# EAGLE schematic MainBoard_project (EAGLE 9.2.2)
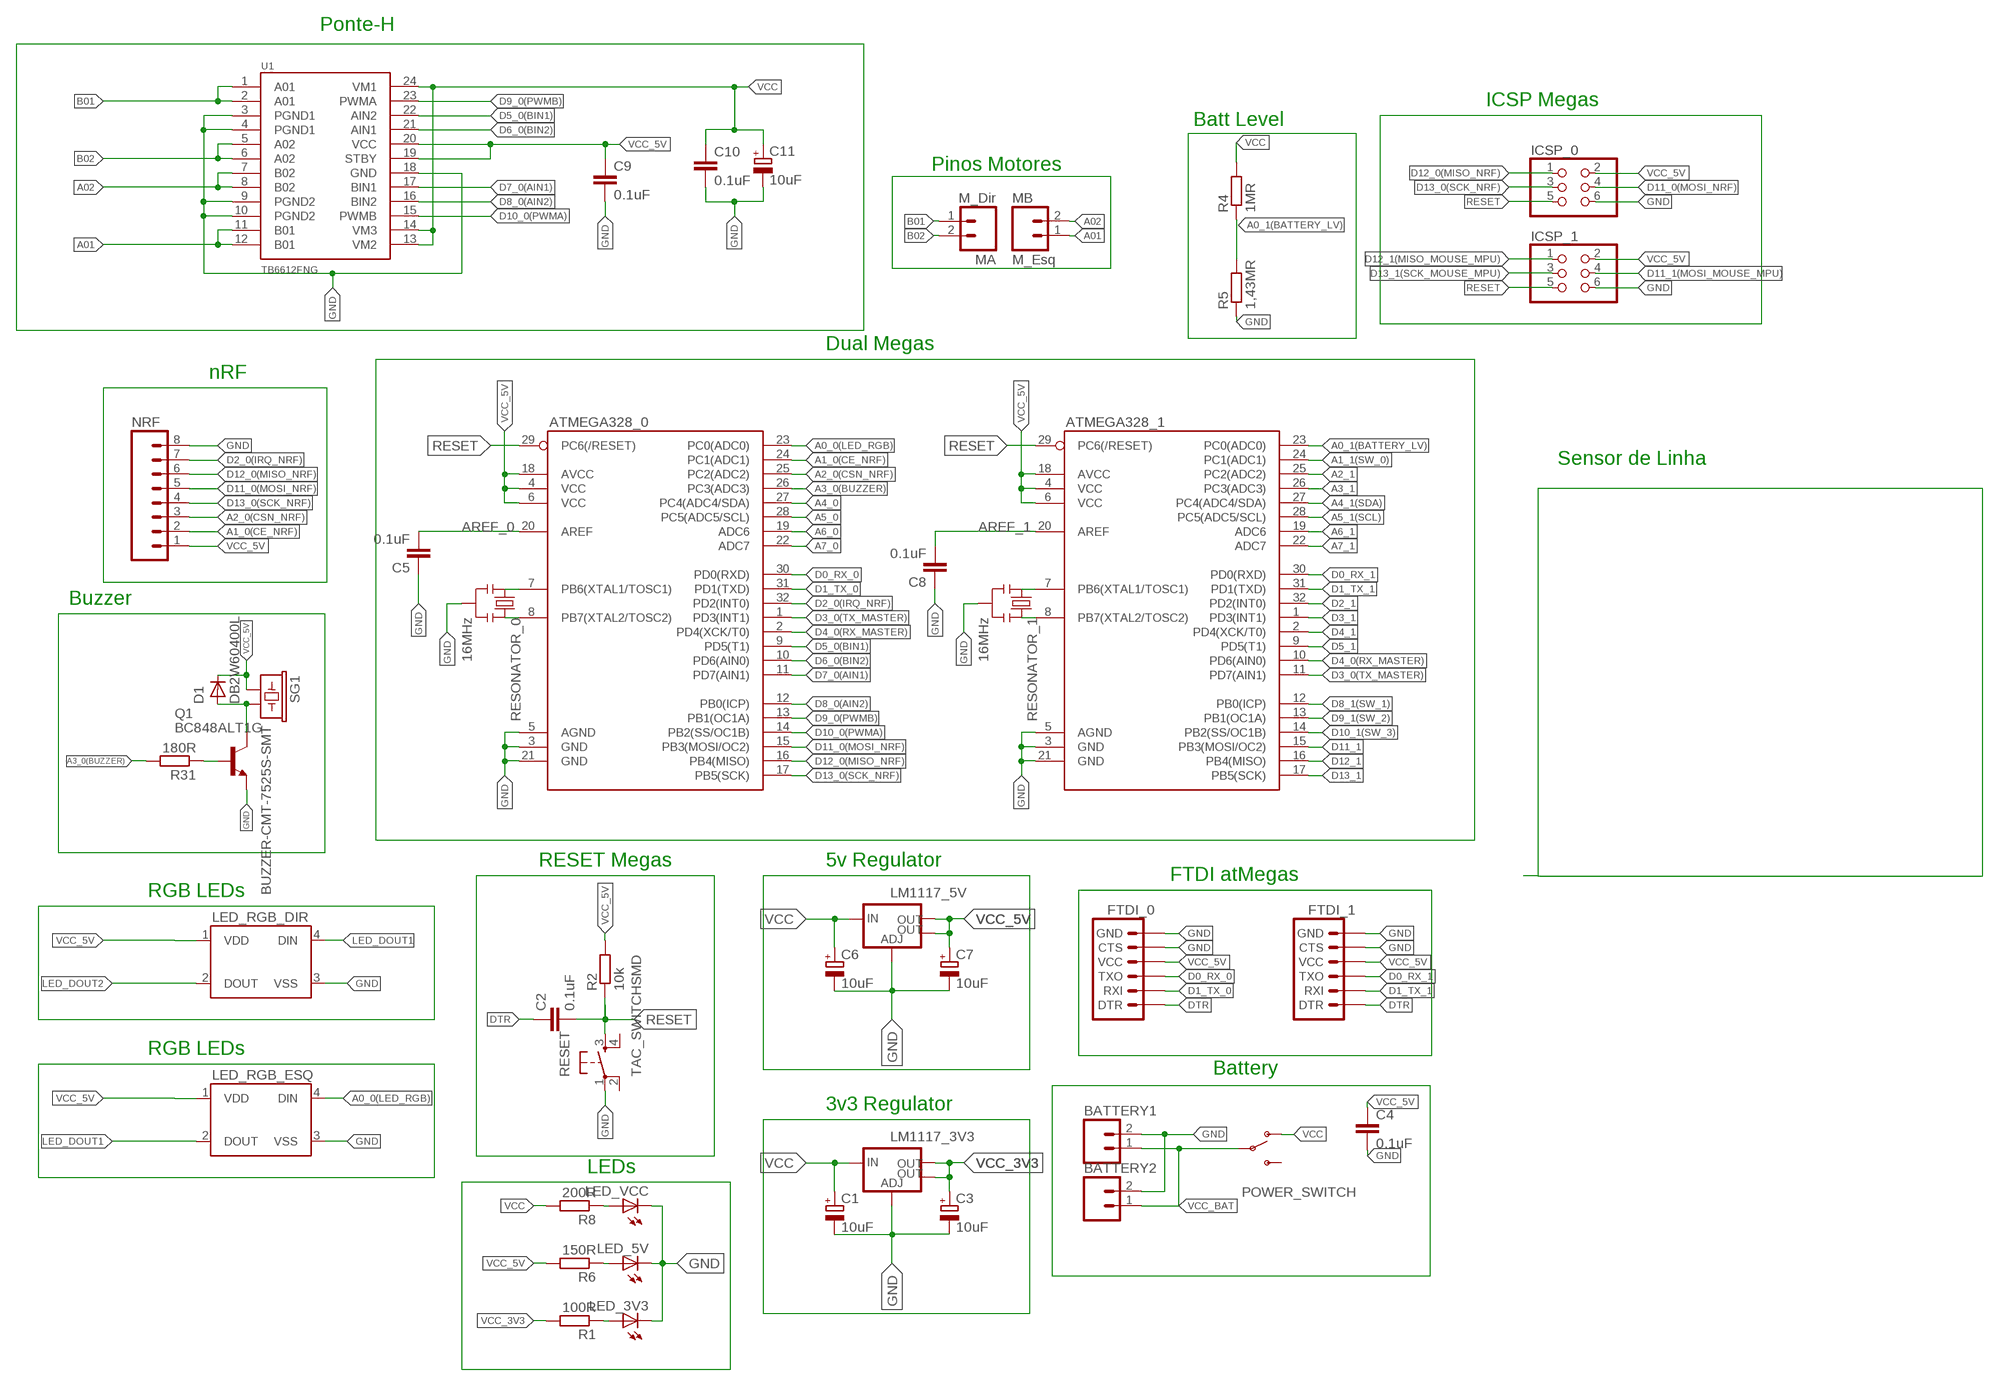
[diagram p0: schematic, sheet 1]

## Parts
ATMEGA328_0  ATMEGA168  [TQFP32-08]
ATMEGA328_1  ATMEGA168  [TQFP32-08]
BATTERY1  M02POLAR  [MOLEX-1X2]
BATTERY2  M02POLAR  [MOLEX-1X2]
C1  10uF  CPOL-EUB/3528-21W  [B/3528-21W]
C2  0.1uF  C-EUC0805K  [C0805K]
C3  10uF  CPOL-EUB/3528-21W  [B/3528-21W]
C4  0.1uF  C-EUC0805K  [C0805K]
C5  0.1uF  C-EUC0805K  [C0805K]
C6  10uF  CPOL-EUB/3528-21W  [B/3528-21W]
C7  10uF  CPOL-EUB/3528-21W  [B/3528-21W]
C8  0.1uF  C-EUC0805K  [C0805K]
C9  0.1uF  C-EUC0805K  [C0805K]
C10  0.1uF  C-EUC0805K  [C0805K]
C11  10uF  CPOL-EUB/3528-21W  [B/3528-21W]
D1  DB2W60400L  GF1  [SMA-DO214AC]
FTDI_0  ARDUINO_SERIAL_PROGRAMPTH  [1X06]
FTDI_1  ARDUINO_SERIAL_PROGRAMPTH  [1X06]
ICSP_0  0114_PH254-203DF118A00V  [2X03]
ICSP_1  0114_PH254-203DF118A00V  [2X03]
LED_3V3  LEDCHIP-LED0805  [CHIP-LED0805]
LED_5V  LEDCHIP-LED0805  [CHIP-LED0805]
LED_RGB_DIR  WS2812B  [WS2812B]
LED_RGB_ESQ  WS2812B  [WS2812B]
LED_VCC  LEDCHIP-LED0805  [CHIP-LED0805]
LM1117_3V3  V_REG_LM1117SOT223  [SOT223]
LM1117_5V  V_REG_LM1117SOT223  [SOT223]
MA  M_Dir  M02POLAR  [MOLEX-1X2]
MB  M_Esq  M02POLAR  [MOLEX-1X2]
NRF  M08  [1X08_ROUND]
POWER_SWITCH  SWITCH-SPDTPTH  [SWITCH-SPDT]
Q1  BC848ALT1G  BC848ALT1SMD  [SOT23]
R1  100R  R-EU_R0805  [R0805]
R2  10k  R-EU_R0805  [R0805]
R4  1MR  R-EU_R0805  [R0805]
R5  1,43MR  R-EU_R0805  [R0805]
R6  150R  R-EU_R0805  [R0805]
R8  200R  R-EU_R0805  [R0805]
R31  180R  R-EU_R0805  [R0805]
RESET  TAC_SWITCHSMD  [TACTILE-SWITCH-SMD]
RESONATOR_0  16MHz  RESONATOR16MHZ  [RESONATOR-SMD]
RESONATOR_1  16MHz  RESONATOR16MHZ  [RESONATOR-SMD]
SG1  BUZZER-CMT-7525S-SMT  [CMT-7525S-SMT]
U1  TB6612FNG  TB6621FNG  [SSOP24]

## Nets
A0_0(LED_RGB): ATMEGA328_0.23(PC0(ADC0)) LED_RGB_ESQ.4(DIN)
A0_1(BATTERY_LV): ATMEGA328_1.23(PC0(ADC0)) R4.1 R5.2
A01: MB.1 U1.11(B01) U1.12(B01)
A1_0(CE_NRF): ATMEGA328_0.24(PC1(ADC1)) NRF.2
A1_1(SW_0): ATMEGA328_1.24(PC1(ADC1))
A02: MB.2 U1.7(B02) U1.8(B02)
A2_0(CSN_NRF): ATMEGA328_0.25(PC2(ADC2)) NRF.3
A2_1: ATMEGA328_1.25(PC2(ADC2))
A3_0(BUZZER): ATMEGA328_0.26(PC3(ADC3)) R31.2
A3_1: ATMEGA328_1.26(PC3(ADC3))
A4_0: ATMEGA328_0.27(PC4(ADC4/SDA))
A4_1(SDA): ATMEGA328_1.27(PC4(ADC4/SDA))
A5_0: ATMEGA328_0.28(PC5(ADC5/SCL))
A5_1(SCL): ATMEGA328_1.28(PC5(ADC5/SCL))
A6_0: ATMEGA328_0.19(ADC6)
A6_1: ATMEGA328_1.19(ADC6)
A7_0: ATMEGA328_0.22(ADC7)
A7_1: ATMEGA328_1.22(ADC7)
AREF_0: ATMEGA328_0.20(AREF) C5.2
AREF_1: ATMEGA328_1.20(AREF) C8.2
B01: MA.1 U1.1(A01) U1.2(A01)
B02: MA.2 U1.5(A02) U1.6(A02)
D0_RX_0: ATMEGA328_0.30(PD0(RXD)) FTDI_0.3(TXO)
D0_RX_1: ATMEGA328_1.30(PD0(RXD)) FTDI_1.3(TXO)
D1_TX_0: ATMEGA328_0.31(PD1(TXD)) FTDI_0.2(RXI)
D1_TX_1: ATMEGA328_1.31(PD1(TXD)) FTDI_1.2(RXI)
D2_0(IRQ_NRF): ATMEGA328_0.32(PD2(INT0)) NRF.7
D2_1: ATMEGA328_1.32(PD2(INT0))
D3_0(TX_MASTER): ATMEGA328_0.1(PD3(INT1)) ATMEGA328_1.11(PD7(AIN1))
D3_1: ATMEGA328_1.1(PD3(INT1))
D4_0(RX_MASTER): ATMEGA328_0.2(PD4(XCK/T0)) ATMEGA328_1.10(PD6(AIN0))
D4_1: ATMEGA328_1.2(PD4(XCK/T0))
D5_0(BIN1): ATMEGA328_0.9(PD5(T1)) U1.22(AIN2)
D5_1: ATMEGA328_1.9(PD5(T1))
D6_0(BIN2): ATMEGA328_0.10(PD6(AIN0)) U1.21(AIN1)
D7_0(AIN1): ATMEGA328_0.11(PD7(AIN1)) U1.17(BIN1)
D8_0(AIN2): ATMEGA328_0.12(PB0(ICP)) U1.16(BIN2)
D8_1(SW_1): ATMEGA328_1.12(PB0(ICP))
D9_0(PWMB): ATMEGA328_0.13(PB1(OC1A)) U1.23(PWMA)
D9_1(SW_2): ATMEGA328_1.13(PB1(OC1A))
D10_0(PWMA): ATMEGA328_0.14(PB2(SS/OC1B)) U1.15(PWMB)
D10_1(SW_3): ATMEGA328_1.14(PB2(SS/OC1B))
D11_0(MOSI_NRF): ATMEGA328_0.15(PB3(MOSI/OC2)) ICSP_0.4 NRF.5
D11_1: ATMEGA328_1.15(PB3(MOSI/OC2))
D11_1(MOSI_MOUSE_MPU): ICSP_1.4
D12_0(MISO_NRF): ATMEGA328_0.16(PB4(MISO)) ICSP_0.1 NRF.6
D12_1: ATMEGA328_1.16(PB4(MISO))
D12_1(MISO_MOUSE_MPU): ICSP_1.1
D13_0(SCK_NRF): ATMEGA328_0.17(PB5(SCK)) ICSP_0.3 NRF.4
D13_1: ATMEGA328_1.17(PB5(SCK))
D13_1(SCK_MOUSE_MPU): ICSP_1.3
DTR: C2.1 FTDI_0.1(DTR) FTDI_1.1(DTR)
GND: ATMEGA328_0.3(GND) ATMEGA328_0.5(AGND) ATMEGA328_0.21(GND) ATMEGA328_1.3(GND) ATMEGA328_1.5(AGND) ATMEGA328_1.21(GND) BATTERY1.2 BATTERY2.2 C1.- C3.- C4.2 C5.1 C6.- C7.- C8.1 C9.2 C10.2 C11.- FTDI_0.5(CTS) FTDI_0.6(GND) FTDI_1.5(CTS) FTDI_1.6(GND) ICSP_0.6 ICSP_1.6 LED_3V3.C LED_5V.C LED_RGB_DIR.3(VSS) LED_RGB_ESQ.3(VSS) LED_VCC.C LM1117_3V3.1(ADJ) LM1117_5V.1(ADJ) NRF.8 Q1.2(E) R5.1 RESET.1 RESONATOR_0.2 RESONATOR_1.2 U1.3(PGND1) U1.4(PGND1) U1.9(PGND2) U1.10(PGND2) U1.18(GND)
LED_DOUT1: LED_RGB_DIR.4(DIN) LED_RGB_ESQ.2(DOUT)
LED_DOUT2: LED_RGB_DIR.2(DOUT)
N$2: LED_VCC.A R8.1
N$4: ATMEGA328_1.8(PB7(XTAL2/TOSC2)) RESONATOR_1.3
N$8: ATMEGA328_0.8(PB7(XTAL2/TOSC2)) RESONATOR_0.3
N$9: ATMEGA328_0.7(PB6(XTAL1/TOSC1)) RESONATOR_0.1
N$10: ATMEGA328_1.7(PB6(XTAL1/TOSC1)) RESONATOR_1.1
N$18: LED_3V3.A R1.1
N$19: LED_5V.A R6.1
N$80: Q1.1(B) R31.1
N$85: D1.A Q1.3(C) SG1.P$1 SG1.P$2
RESET: ATMEGA328_0.29(PC6(/RESET)) ATMEGA328_1.29(PC6(/RESET)) C2.2 ICSP_0.5 ICSP_1.5 R2.1 RESET.3
VCC: C1.+ C6.+ C10.1 C11.+ LM1117_3V3.3(IN) LM1117_5V.3(IN) POWER_SWITCH.1(O) R4.2 R8.2 U1.13(VM2) U1.14(VM3) U1.24(VM1)
VCC_3V3: C3.+ LM1117_3V3.2(OUT) LM1117_3V3.4(OUT) R1.2
VCC_5V: ATMEGA328_0.4(VCC) ATMEGA328_0.6(VCC) ATMEGA328_0.18(AVCC) ATMEGA328_1.4(VCC) ATMEGA328_1.6(VCC) ATMEGA328_1.18(AVCC) C4.1 C7.+ C9.1 D1.K(C) FTDI_0.4(VCC) FTDI_1.4(VCC) ICSP_0.2 ICSP_1.2 LED_RGB_DIR.1(VDD) LED_RGB_ESQ.1(VDD) LM1117_5V.2(OUT) LM1117_5V.4(OUT) NRF.1 R2.2 R6.2 SG1.P$3 SG1.P$4 U1.19(STBY) U1.20(VCC)
VCC_BAT: BATTERY1.1 BATTERY2.1 POWER_SWITCH.2(P)
Unconnected: POWER_SWITCH.3(S) RESET.2 RESET.4

## Notes on the sheet
- Ponte-H
- ICSP Megas
- Batt Level
- Pinos Motores
- Dual Megas
- nRF
- Sensor de Linha
- Buzzer
- RESET Megas | 5v Regulator
- FTDI atMegas
- RGB LEDs
- RGB LEDs
- Battery
- 3v3 Regulator
- LEDs

## Library data of the parts
ATMEGA328_0 ATMEGA328_1 = SparkFun:ATMEGA168
BATTERY1 BATTERY2 MA MB = SparkFun-Connectors:M02: Standard 2-pin 0.1" header. Use with - straight break away headers ( PRT-00116) - right angle break away headers (PRT-00553) - swiss pins (PRT-00743) - machine pins (PRT-00117) - female headers (PRT-00115) Molex polarized connector foot print use with: PRT-08233 with associated crimp pins and housings. 2.54_SCREWTERM for use with PRT-10571. 3.5mm Screw Terminal footprints for PRT-08084 5mm Screw Terminal footprints for use with PRT-08432
C1 C3 C6 C7 C11 = resistor:CPOL-EU: POLARIZED CAPACITOR, European symbol
C2 C4 C5 C8-C10 = resistor:C-EU: CAPACITOR, European symbol
D1 = diode:GF1: DIODE
FTDI_0 FTDI_1 = SparkFun:ARDUINO_SERIAL_PROGRAM
ICSP_0 ICSP_1 = Connettori:0114_PH254-203DF118A00V: 3x2 M V h 8,5 mm p2,54; MONTHLY_USAGE: _____; PART_NUMBER: PH254-203DF118A00V; PRICE: _____; SUPPLIER: _____; TYPE: Connettori; VALUE: ICSP
LED_3V3 LED_5V LED_VCC = led:LED: LED OSRAM: - CHIPLED LG R971, LG N971, LY N971, LG Q971, LY Q971, LO R971, LY R971 LH N974, LH R974 LS Q976, LO Q976, LY Q976 LO Q996 - Hyper CHIPLED LW Q18S LB Q993, LB Q99A, LB R99A - SideLED LS A670, LO A670, LY A670, LG A670, LP A670 LB A673, LV A673, LT A673, LW A673 LH A674 LY A675 LS A676, LA A676, LO A676, LY A676, LW A676 LS A679, LY A679, LG A679 - Hyper Micro SIDELED® LS Y876, LA Y876, LO Y876, LY Y876 LT Y87S - SmartLED LW L88C, LW L88S LB L89C, LB L89S, LG L890 LS L89K, LO L89K, LY L89K LS L896, LA L896, LO L896, LY L896 - TOPLED LS T670, LO T670, LY T670, LG T670, LP T670 LSG T670, LSP T670, LSY T670, LOP T670, LYG T670 LG T671, LOG T671, LSG T671 LB T673, LV T673, LT T673, LW T673 LH T674 LS T676, LA T676, LO T676, LY T676, LB T676, LH T676, LSB T676, LW T676 LB T67C, LV T67C, LT T67C, LS T67K, LO T67K, LY T67K, LW E67C LS E67B, LA E67B, LO E67B, LY E67B, LB E67C, LV E67C, LT E67C LW T67C LS T679, LY T679, LG T679 LS T770, LO T770, LY T770, LG T770, LP T770 LB T773, LV T773, LT T773, LW T773 LH T774 LS E675, LA E675, LY E675, LS T675 LS T776, LA T776, LO T776, LY T776, LB T776 LHGB T686 LT T68C, LB T68C - Hyper Mini TOPLED® LB M676 - Mini TOPLED Santana® LG M470 LS M47K, LO M47K, LY M47K Source: http://www.osram.convergy.de LUXEON: - LUMILED® LXK2-PW12-R00, LXK2-PW12-S00, LXK2-PW14-U00, LXK2-PW14-V00 LXK2-PM12-R00, LXK2-PM12-S00, LXK2-PM14-U00 LXK2-PE12-Q00, LXK2-PE12-R00, LXK2-PE12-S00, LXK2-PE14-T00, LXK2-PE14-U00 LXK2-PB12-K00, LXK2-PB12-L00, LXK2-PB12-M00, LXK2-PB14-N00, LXK2-PB14-P00, LXK2-PB14-Q00 LXK2-PR12-L00, LXK2-PR12-M00, LXK2-PR14-Q00, LXK2-PR14-R00 LXK2-PD12-Q00, LXK2-PD12-R00, LXK2-PD12-S00 LXK2-PH12-R00, LXK2-PH12-S00 LXK2-PL12-P00, LXK2-PL12-Q00, LXK2-PL12-R00 Source: www.luxeon.com KINGBRIGHT: KA-3528ASYC Source: www.kingbright.com
LED_RGB_DIR LED_RGB_ESQ = SparkFun-LED:WS2812B: WS2812B - Intelligent control LED integrated light source Technical Specifications: Power Supply Voltage (VDD): 3.5 to 5.3 V Input Voltage (VI): -0.5 to VDD+0.5 V Operating Junction Temperature (Topt): -25°C to +80°C Storage Temperature Range (Tstg): -55°C to +150°C; PROD_ID: DIO-12503
LM1117_3V3 LM1117_5V = SparkFun-PowerIC:V_REG_LM1117: Voltage Regulator LM1117 Standard adjustable voltage regulator but in SMD form. Spark Fun Electronics SKU : COM-00595; PROD_ID: VREG-08170
NRF = SparkFun-Connectors:M08: Header 8 Standard 8-pin 0.1" header. Use with straight break away headers (SKU : PRT-00116), right angle break away headers (PRT-00553), swiss pins (PRT-00743), machine pins (PRT-00117), and female headers (PRT-00115).; PROD_ID: CONN-08437
POWER_SWITCH = SparkFun-Electromechanical:SWITCH-SPDT: SPDT Switch Simple slide switch, Spark Fun Electronics SKU : COM-00102 DPDT SMT slide switch, AYZ0202, SWCH-08179
Q1 = transistor-npn:BC848*: NPN Transistor
R1 R2 R4-R6 R8 R31 = resistor:R-EU_: RESISTOR, European symbol
RESET = SparkFun-Retired:TAC_SWITCH: Momentary Switch Button commonly used for reset or general input. Spark Fun Electronics SKU : COM-00097 SMT- SWCH-08247; PROD_ID: SWCH-08247
RESONATOR_0 RESONATOR_1 = SparkFun-FreqCtrl:RESONATOR: Resonator Small SMD resonator. Used, eg, on the Arduino Pro/ Pro Mini boards. 8MHz- XTAL-08895 16MHz- XTAL-08900; PROD_ID: XTAL-08900
SG1 = RoboCIn:BUZZER-CMT-7525S-SMT
U1 = SparkFun-PowerIC:TB6621FNG: Toshiba 1A dual motor driver IC-09363; PROD_ID: IC-09363